# EAGLE design TWELITE_meas_2 (EAGLE 9.6.2)
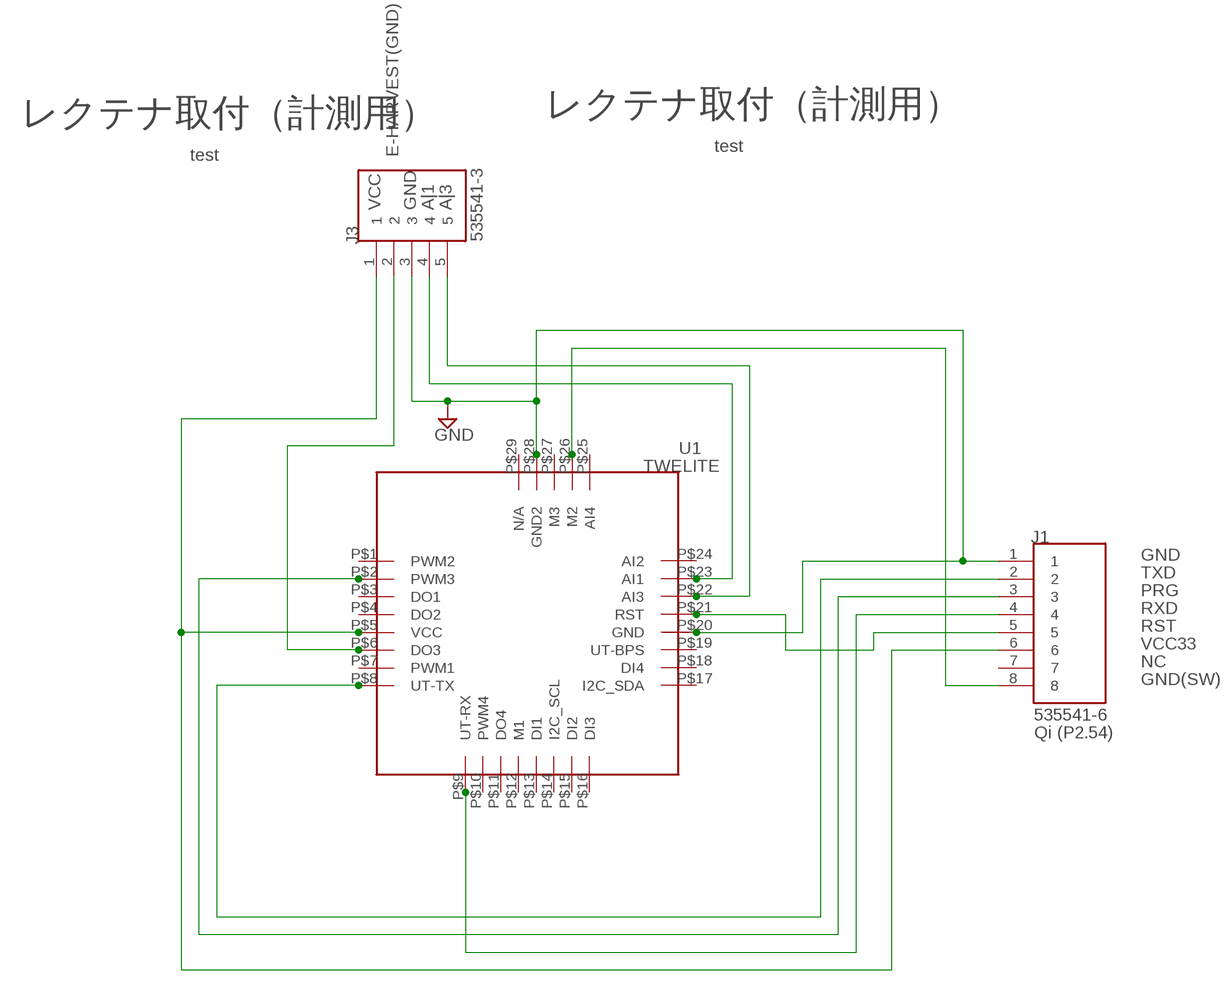
[diagram p0: schematic, sheet 1]

## Parts
J1  535541-6  [TE_535541-6]
J3  535541-3  [TE_535541-3]
U1  LITE_1  [LITE_1]

## Nets
A|1: J3.4 U1.P$23(AI1)
A|3: J3.5 U1.P$22(AI3)
E-HARVEST_GND: J3.2 U1.P$6(DO3)
GND: J1.1 J3.3 U1.P$20(GND) U1.P$28(GND2)
GND_SW: J1.8 U1.P$26(M2)
PRG: J1.3 U1.P$2(PWM3)
RST: J1.5 U1.P$21(RST)
RXD: J1.4 U1.P$9(UT-RX)
TXD: J1.2 U1.P$8(UT-TX)
VCC: J1.6 J3.1 U1.P$5(VCC)
Unconnected: J1.7 U1.P$1(PWM2) U1.P$3(DO1) U1.P$4(DO2) U1.P$7(PWM1) U1.P$10(PWM4) U1.P$11(DO4) U1.P$12(M1) U1.P$13(DI1) U1.P$14(I2C_SCL) U1.P$15(DI2) U1.P$16(DI3) U1.P$17(I2C_SDA) U1.P$18(DI4) U1.P$19(UT-BPS) U1.P$24(AI2) U1.P$25(AI4) U1.P$27(M3) U1.P$29(N/A)

## Notes on the sheet
- レクテナ取付（計測用） | レクテナ取付（計測用）
- E-HARVEST(GND) | test
- test
- VCC | GND | A|1 | A|3
- TWELITE
- GND
- TXD
- PRG
- RXD
- RST
- VCC33
- NC
- GND(SW)
- Qi (P2.54)

## Library data of the parts
J1 = bs_es:535541-6: Check prices <https://pricing.snapeda.com/parts/535541-6/TE%20Connectivity/view-part?ref=eda>; AVAILABILITY: Warning; CENTERLINE_PITCH: 2.54 mm[.1 in]; COMMENT: 535541-6; DESCRIPTION: 08 MODIV VRT SR CE 100/115; EU_ROHS_COMPLIANCE: Not Compliant; MF: TE Connectivity; MP: 535541-6; NUMBER_OF_POSITIONS: 8; PACKAGE: None; PRICE: None; PRODUCT_TYPE: Connector; PURCHASE-URL: https://pricing.snapeda.com/search/part/535541-6/?ref=eda
J3 = bs_es:535541-3
U1 = bs_es:LITE_1

## Board
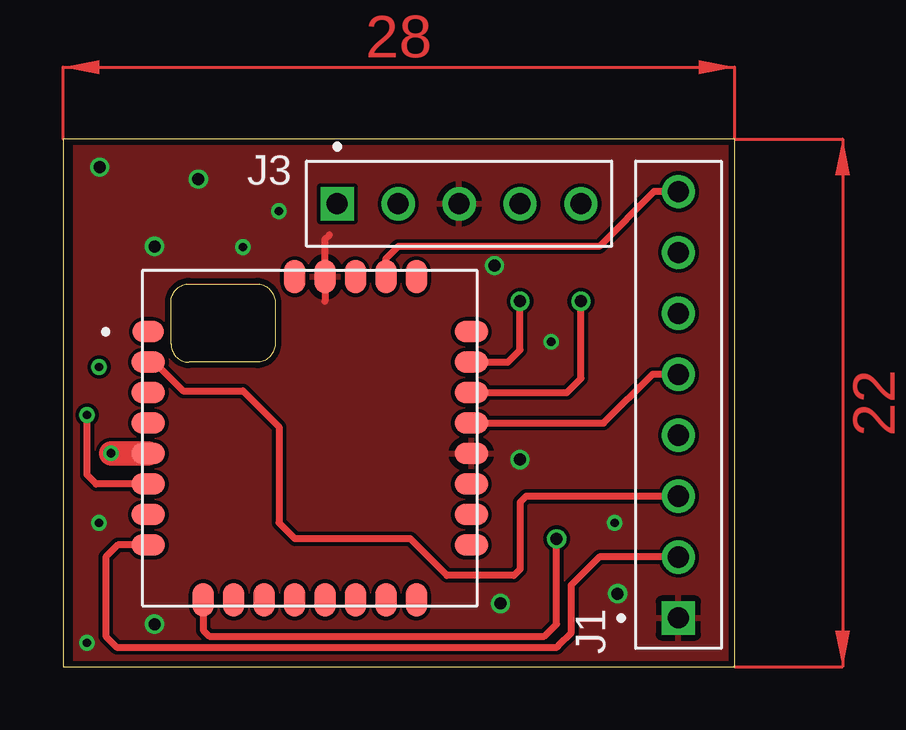
[diagram p1: board, top side]
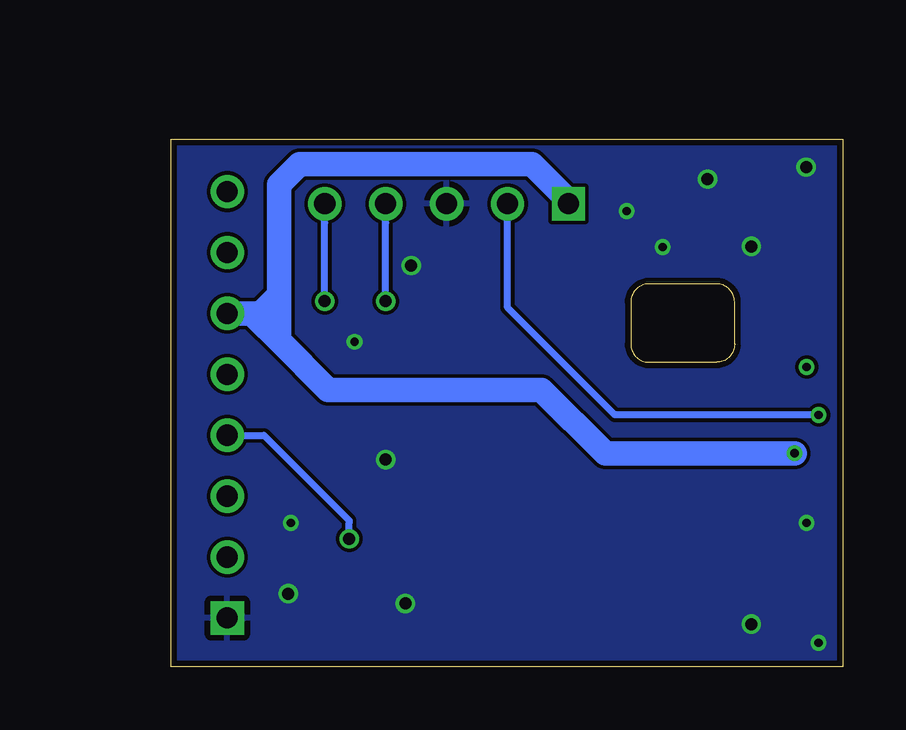
[diagram p2: board, bottom side, seen from below]

Size 28 x 22 mm. Coordinates in mm from the lower left corner, seen from the top.
Outline: 0,0 28,0 28,22 0,22 0,0
Copper layers (1*16): Top 0.035mm / dielectric 1.5mm / Bottom 0.035mm
Design rules "SeeedStudio_2layer_DRU_no_angle_20140221": minimum track width 6mil, minimum drill 12mil, track to track 6mil, track to pad 6mil, pad to pad 6mil, via to via 6mil, smd to smd 0mil, copper to edge 10mil, drill to drill 10mil, minimum pad ring 10mil, minimum via ring 6mil, stop-mask expansion 2mil, vias tented up to drill 100mil, thermal gap 10mil
tRestrict: 5 lines

### Footprints (pad centres in the part's own frame; a part is rotated, then mirrored left to right if it is on the bottom)
TE_535541-6 = drill 0.88 square: 1 -8.89,0 | drill 0.88: 2 -6.35,0; 3 -3.81,0; 4 -1.27,0; 5 1.27,0; 6 3.81,0; 7 6.35,0; 8 8.89,0
TE_535541-3 = drill 0.88 square: 1 0,0 | drill 0.88: 2 2.54,0; 3 5.08,0; 4 7.62,0; 5 10.16,0
LITE_1 = smd 1.32 x 0.9: P$1 0.25,11.43 | smd 1.4 x 0.9: P$2 0.25,10.16; P$3 0.25,8.89; P$4 0.25,7.62; P$5 0.25,6.35; P$6 0.25,5.08; P$7 0.25,3.81; P$8 0.25,2.54; P$17 13.72,2.54; P$18 13.72,3.81; P$19 13.72,5.08; P$20 13.72,6.35; P$21 13.72,7.62; P$22 13.72,8.89; P$23 13.72,10.16; P$24 13.72,11.43 | smd 0.9 x 1.4: P$9 2.54,0.25; P$10 3.81,0.25; P$11 5.08,0.25; P$12 6.35,0.25; P$13 7.62,0.25; P$14 8.89,0.25; P$15 10.16,0.25; P$16 11.43,0.25; P$25 11.43,13.72; P$26 10.16,13.72; P$27 8.89,13.72; P$28 7.62,13.72; P$29 6.35,13.72

### Placement (x,y rotation side)
J1  25.65,10.92 90 top
J3  11.43,19.3 0 top
U1  3.3,2.54 0 top

### Tracks (layer width: path | path; a pad name or v marks a point on that pad's centre or on a via)
A|1  (via drill 0.5)
  Top 0.3: v19.05,15.24 19.05,13.21 18.54,12.7 U1.P$23
  Bottom 0.3: v19.05,15.24 19.05,18.5 19.05,19.05 J3.4
A|3  (via drill 0.5)
  Top 0.3: U1.P$22 21,11.43 21.59,12.02 v21.59,15.24
  Bottom 0.3: v21.59,15.24 21.59,18.5 21.59,19.05 J3.5
E-HARVEST_GND  (via drill 0.35)
  Top 0.3: U1.P$6 1.38,7.62 1,8 v1,10.5
  Bottom 0.3: J3.2 13.97,14.97 9.5,10.5 v1,10.5
GND  (via drill 0.35, 0.5)
  Top 0.3: 10.92,16 10.92,15.24 | 10.92,16.51 10.92,17.53 | 11.1,18 10.92,17.82 U1.P$28 10.92,17.72
  other vias: 23.11,3.05 19.05,8.64 3.81,17.53 5.64,20.33 1.52,20.83 17.99,16.72 3.81,1.78 18.23,2.64 1.5,6 1,1 23,6 20.35,13.55 9,19 7.5,17.5
  pour Top: -0.51,22.35 -0.51,-0.51 28.45,-0.51 28.45,22.35 26.92,22.35
  pour Bottom: -0.76,22.61 -0.76,-0.76 0,-0.76 28.7,-0.76 28.7,2.03 28.7,22.61
GND_SW
  Top 0.3: J1.8 24.64,19.81 22.35,17.53 13.97,17.53 13.46,17.02 U1.P$26
N$4  (via drill 0.35)
  other vias: 1.5,12.5
PRG
  Top 0.3: J1.3 19.3,7.11 19.05,6.86 19.05,4.06 18.8,3.81 16,3.81 14.48,5.33 9.67,5.33 9,6 9,10 7.5,11.5 5,11.5 3.8,12.7 U1.P$2
RST
  Top 0.3: J1.5 24.57,12.19 22.54,10.16 22.5,10.16 U1.P$21
RXD  (via drill 0.5)
  Top 0.3: v20.57,5.33 20.57,1.78 20.07,1.27 6.1,1.27 5.84,1.52 U1.P$9
  Bottom 0.3: v20.57,5.33 20.57,6 20.57,6.1 24.13,9.65 J1.4
TXD
  Top 0.3: J1.2 22.35,4.57 21.19,3.41 21.19,1.42 20.64,0.86 20.59,0.82 2.23,0.82 1.78,1.27 1.78,4.57 2.29,5.08 U1.P$8
VCC  (via drill 0.35)
  Top 0.3: U1.P$5 v2.01,8.89
  Top 1.016: v2,8.9 v2.01,8.89 U1.P$5
  Bottom 1.016: v2,8.9 9.9,8.9 12.55,11.55 21.45,11.55 23.5,13.59 | 23.5,13.59 24.45,14.54 24.45,14.55 | J3.1 11.43,19.43 12.95,20.95 22.65,20.95 23.5,20.1 23.5,15.5 | 24.45,14.55 24.45,14.73 J1.6 | 23.5,15.5 23.5,13.59 | 24.45,14.55 23.5,15.5
(copper drawn outside any net)
  shapes: Top area x2